# EAGLE design Apple 2.0C Breakout Board (EAGLE 8.2.1)
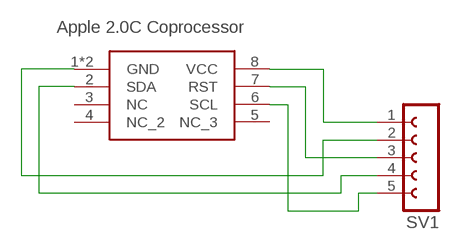
[diagram p0: schematic, sheet 1]

## Parts
SV1  FE05-1  [FE05-1]
U$1  APPLE_2.0C_COPROCESSOR  [PG-USON-8-1]

## Nets
GND: SV1.2 U$1.1(GND) U$1.9(GND)
RST: SV1.3 U$1.7(RST)
SCL: SV1.5 U$1.6(SCL)
SDA: SV1.4 U$1.2(SDA)
VCC: SV1.1 U$1.8(VCC)
Unconnected: U$1.3(NC) U$1.4(NC_2) U$1.5(NC_3)

## Library data of the parts
SV1 = con-lsta:FE05-1: FEMALE HEADER; OC_FARNELL: unknown; OC_NEWARK: unknown
U$1 = thanics_robotics:APPLE_2.0C_COPROCESSOR

## Board
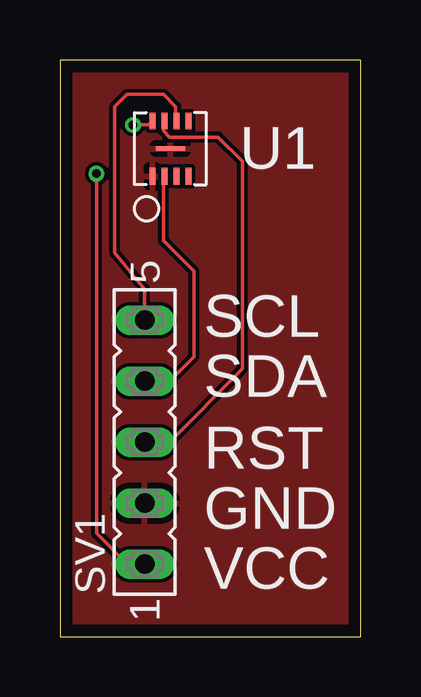
[diagram p1: board, top side]
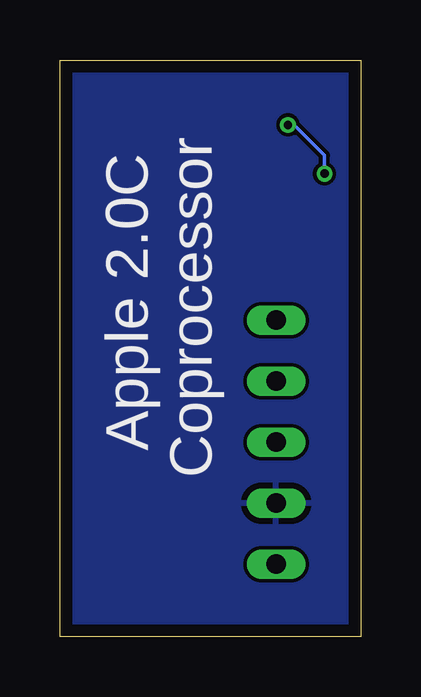
[diagram p2: board, bottom side, seen from below]

Size 12.56 x 24.04 mm. Coordinates in mm from the lower left corner, seen from the top.
Outline: 0,0 12.56,0 12.56,24.04 0,24.04 0,0
Copper layers (1*16): Top 0.035mm / dielectric 1.6mm / Bottom 0.035mm
Design rules "Elecrow_2-layer_PCB_eagle_rule": minimum track width 6mil, minimum drill 12mil, track to track 6mil, track to pad 6mil, pad to pad 6mil, via to via 8mil, smd to smd 0mil, copper to edge 20mil, drill to drill 10mil, minimum pad ring 6mil, minimum via ring 6mil, stop-mask expansion 0mil, vias tented up to drill 100mil, thermal gap 10mil

### Footprints (pad centres in the part's own frame; a part is rotated, then mirrored left to right if it is on the bottom)
FE05-1 = drill 0.813 long: 1 -5.08,0; 2 -2.54,0; 3 0,0; 4 2.54,0; 5 5.08,0
PG-USON-8-1 = smd 0.7 x 0.25: 1 -1.15,0.75; 2 -1.15,0.25; 3 -1.15,-0.25; 4 -1.15,-0.75; 5 1.15,-0.75; 6 1.15,-0.25; 7 1.15,0.25; 8 1.15,0.75 | smd 0.2 x 1.2: 9 0,0

### Placement (x,y rotation side)
SV1  3.54,8.12 90 top
U$1  4.61,20.35 90 top

### Tracks (layer width: path | path; a pad name or v marks a point on that pad's centre or on a via)
GND
  pour Top: 0,24.13 12.45,24.13 12.45,0 0,0
  pour Bottom: 0,24.13 12.45,24.13 12.45,0 0,0
RST
  Top 0.152: SV1.3 4.56,8.12 7.62,11.18 7.62,19.81 6.6,20.83 4.57,20.83 4.32,21.08 4.32,21.46 U$1.7
SCL
  Top 0.152: SV1.5 3.54,14.49 2.29,16 2.29,22.1 2.79,22.61 4.32,22.61 4.83,22.1 4.83,21.53 U$1.6
SDA
  Top 0.152: SV1.4 4.56,10.66 5.59,11.68 5.59,15.24 4.32,16.51 4.32,19.16 U$1.2
VCC  (via drill 0.35)
  Top 0.152: SV1.1 2.8,3.04 1.52,4.32 v1.52,19.3 | v3.05,21.34 3.7,21.34 U$1.8
  Bottom 0.152: v1.52,19.3 1.52,20.07 2.79,21.34 v3.05,21.34

### Text on the board
tNames: U1 | SCL | SDA | RST | GND | VCC
bNames: Apple 2.0C / Coprocessor